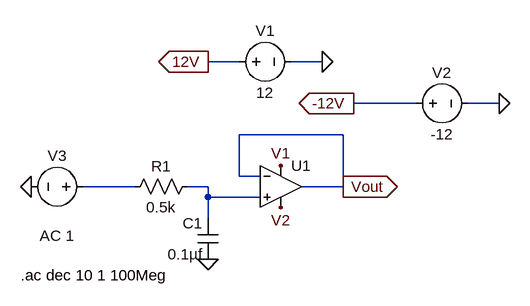
[diagram p0: schematic Active Low Pass Filter.asc]
Active Low Pass Filter.asc, the LTspice schematic file:
Version 4
SHEET 1 880 680
WIRE 384 -112 336 -112
WIRE 512 -112 464 -112
WIRE 656 -48 560 -48
WIRE 784 -48 736 -48
WIRE 544 0 384 0
WIRE 384 64 384 0
WIRE 416 64 384 64
WIRE 224 80 144 80
WIRE 336 80 304 80
WIRE 544 80 544 0
WIRE 544 80 480 80
WIRE 336 96 336 80
WIRE 416 96 336 96
WIRE 336 128 336 96
FLAG 784 -48 0
FLAG 512 -112 0
FLAG 336 -112 12V
IOPIN 336 -112 Out
FLAG 560 -48 -12V
IOPIN 560 -48 Out
FLAG 448 48 V1
FLAG 448 112 V2
FLAG 544 80 Vout
IOPIN 544 80 Out
FLAG 64 80 0
FLAG 336 192 0
SYMBOL OpAmps\\UniversalOpAmp2 448 80 R0
SYMATTR InstName U1
SYMBOL voltage 368 -112 R270
WINDOW 0 32 56 VTop 2
WINDOW 3 -32 56 VBottom 2
WINDOW 123 0 0 Left 0
WINDOW 39 0 0 Left 0
SYMATTR InstName V1
SYMATTR Value 12
SYMBOL voltage 640 -48 R270
WINDOW 0 32 56 VTop 2
WINDOW 3 -32 56 VBottom 2
WINDOW 123 0 0 Left 0
WINDOW 39 0 0 Left 0
SYMATTR InstName V2
SYMATTR Value -12
SYMBOL voltage 160 80 R90
WINDOW 0 -32 56 VBottom 2
WINDOW 3 32 56 VTop 2
WINDOW 123 60 56 VTop 2
WINDOW 39 0 0 Left 0
SYMATTR InstName V3
SYMATTR Value ""
SYMATTR Value2 AC 1
SYMBOL cap 352 192 R180
WINDOW 0 24 56 Left 2
WINDOW 3 24 8 Left 2
SYMATTR InstName C1
SYMATTR Value 0.1µf
SYMBOL res 320 64 R90
WINDOW 0 0 56 VBottom 2
WINDOW 3 32 56 VTop 2
SYMATTR InstName R1
SYMATTR Value 0.5k
TEXT 48 216 Left 2 !.ac dec 10 1 100Meg

The netlist it stands for:
* Active Low Pass Filter.asc
XU1 N002 Vout V1 V2 Vout level2 Avol=1Meg GBW=10Meg Slew=10Meg Ilimit=25m Rail=0 Vos=0 En=0 Enk=0 In=0 Ink=0 Rin=500Meg  ; pins In+ In- V+ V- OUT
V1 12V 0 12
V2 -12V 0 -12
V3 N001 0 AC 1
C1 0 N002 0.1µf
R1 N002 N001 0.5k
.ac dec 10 1 100Meg
.lib UniversalOpAmp2.lib
.backanno
.end